# EAGLE schematic MAX485_Shield (EAGLE 6.4)
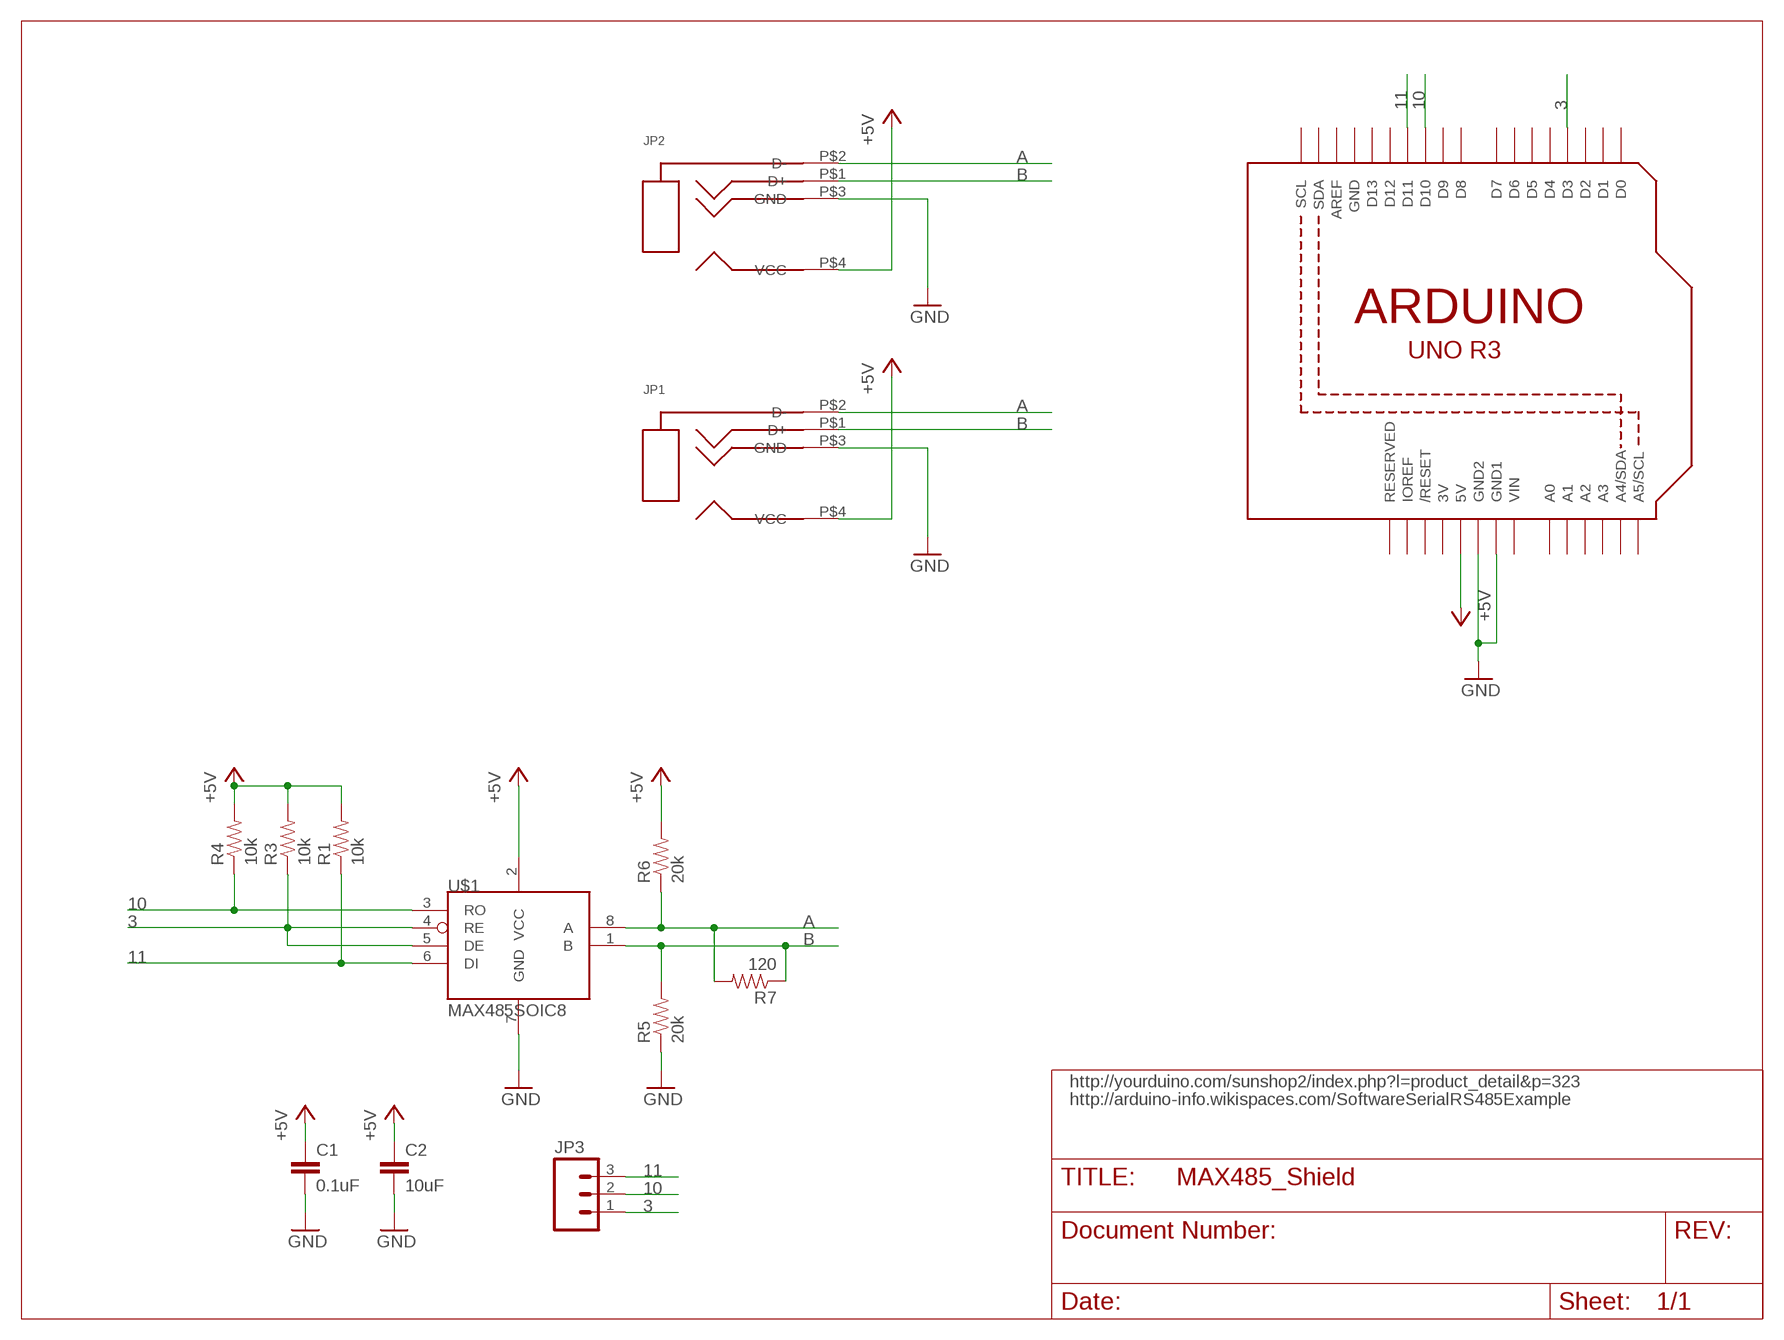
[diagram p0: schematic, sheet 1]

## Parts
C1  0.1uF  CAP0805  [0805]
C2  10uF  CAP0805  [0805]
JP1  AUDIOJACK-4CONTACTS  [SJ-4351X-SMT]
JP2  AUDIOJACK-4CONTACTS  [SJ-4351X-SMT]
JP3  M03PTH  [1X03]
R1  10k  RESISTOR0805-RES  [0805]
R3  10k  RESISTOR0805-RES  [0805]
R4  10k  RESISTOR0805-RES  [0805]
R5  20k  RESISTOR0805-RES  [0805]
R6  20k  RESISTOR0805-RES  [0805]
R7  120  RESISTOR0805-RES  [0805]
U1  ARDUINOR3-BPLACE  [ARDUINOR3-BPLACE]
U$1  MAX485SOIC8  [SOIC8]

## Nets
3: JP3.1 R3.1 U1.D3 U$1.4(RE) U$1.5(DE)
10: JP3.2 R4.1 U1.D10 U$1.3(RO)
11: JP3.3 R1.1 U1.D11 U$1.6(DI)
+5V: C1.1 C2.1 JP1.P$4(VCC) JP2.P$4(VCC) R1.2 R3.2 R4.2 R6.2 U1.5V U$1.2(VCC)
A: JP1.P$2(D-) JP2.P$2(D-) R6.1 R7.2 U$1.8(A)
B: JP1.P$1(D+) JP2.P$1(D+) R5.2 R7.1 U$1.1(B)
GND: C1.2 C2.2 JP1.P$3(GND) JP2.P$3(GND) R5.1 U1.GND1 U1.GND2 U$1.7(GND)
Unconnected: U1.A0 U1.A1 U1.A2 U1.A3 U1.A4(A4/SDA) U1.A5(A5/SCL) U1.AREF U1.D0 U1.D1 U1.D2 U1.D4 U1.D5 U1.D6 U1.D7 U1.D8 U1.D9 U1.D12 U1.D13 U1.IOREF U1.RESERVED U1.RESET(/RESET) U1.SCL U1.SDA

## Notes on the sheet
- http://yourduino.com/sunshop2/index.php?l=product_detail&p=323
- http://arduino-info.wikispaces.com/SoftwareSerialRS485Example

## Power pins joined to a net without a drawn wire
3V: U1.3V
GND: U1.GND
VIN: U1.VIN

## Library data of the parts
C1 C2 = SparkFun-Passives:CAP: Capacitor Standard 0603 ceramic capacitor, and 0.1" leaded capacitor.
JP1 JP2 = NewParts:AUDIOJACK-4CONTACTS
JP3 = SparkFun-Connectors:M03: Header 3 Standard 3-pin 0.1" header. Use with straight break away headers (SKU : PRT-00116), right angle break away headers (PRT-00553), swiss pins (PRT-00743), machine pins (PRT-00117), and female headers (PRT-00115). Molex polarized connector foot print use with SKU : PRT-08232 with associated crimp pins and housings.
R1 R3-R7 = SparkFun-Resistors:RESISTOR: Resistor Basic schematic elements and footprints for 0603, 1206, and PTH resistors.
U1 = adafruit:ARDUINOR3: This is a new object for the new Arduino R3 - with extra pins that you may want to use (such as IOref, and duplicated A4/A5
U$1 = digikey:MAX485